# Altium schematic sheet RF-UNIT.SCHDOC
size 699 x 500 mm; SheetNumber: 1; SheetTotal: 1; DocumentName: Лист 1.SCHDOC
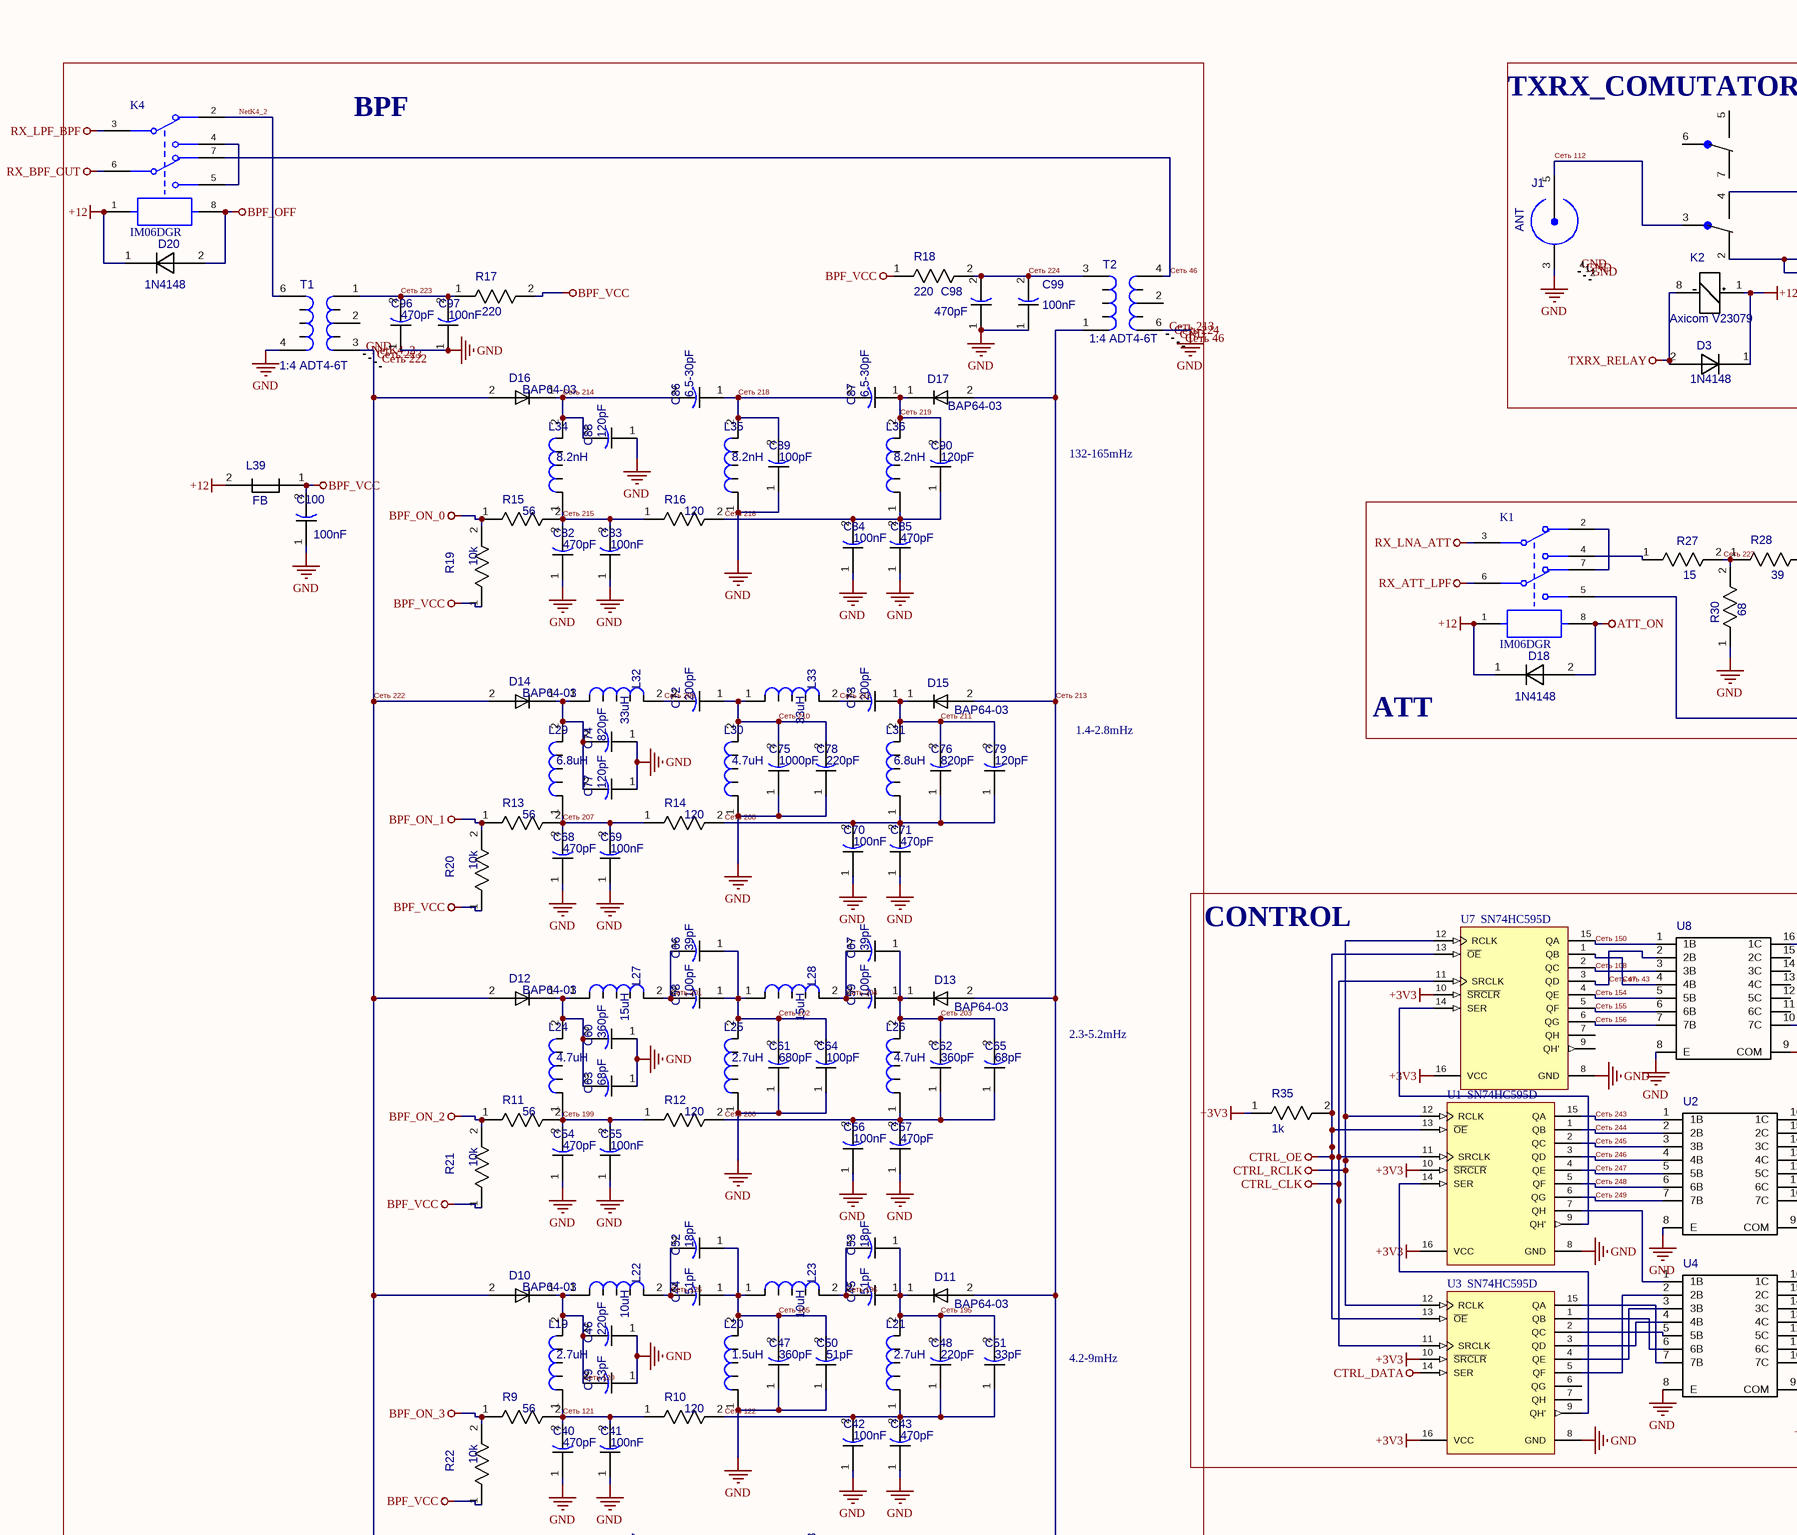
[diagram p0: RF-UNIT.SCHDOC, top left]
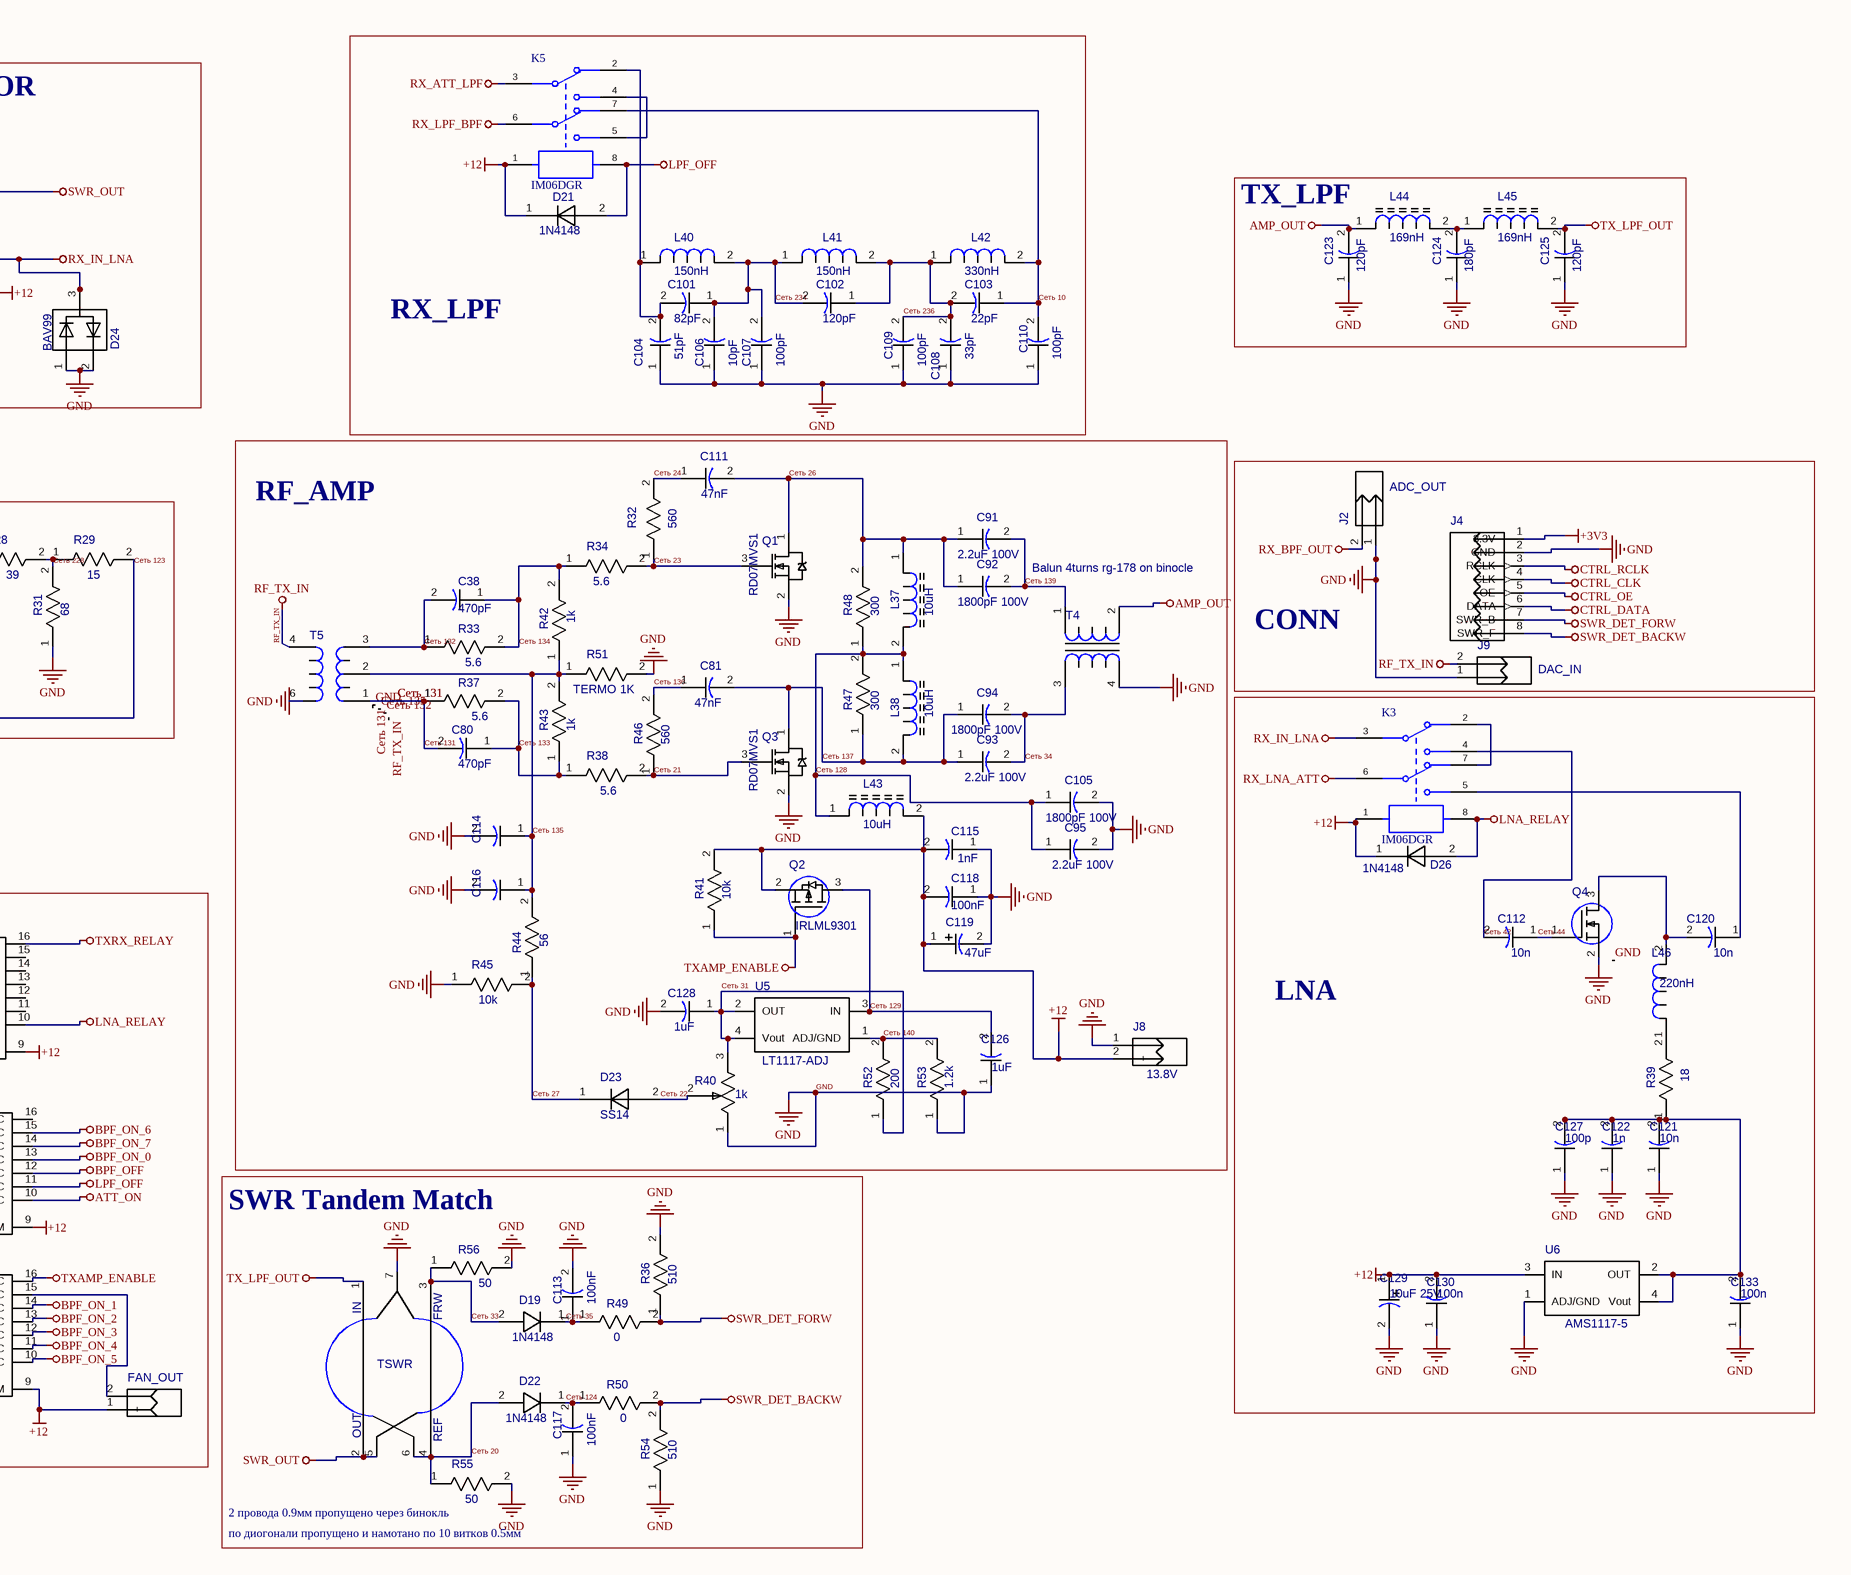
[diagram p1: RF-UNIT.SCHDOC, top right]
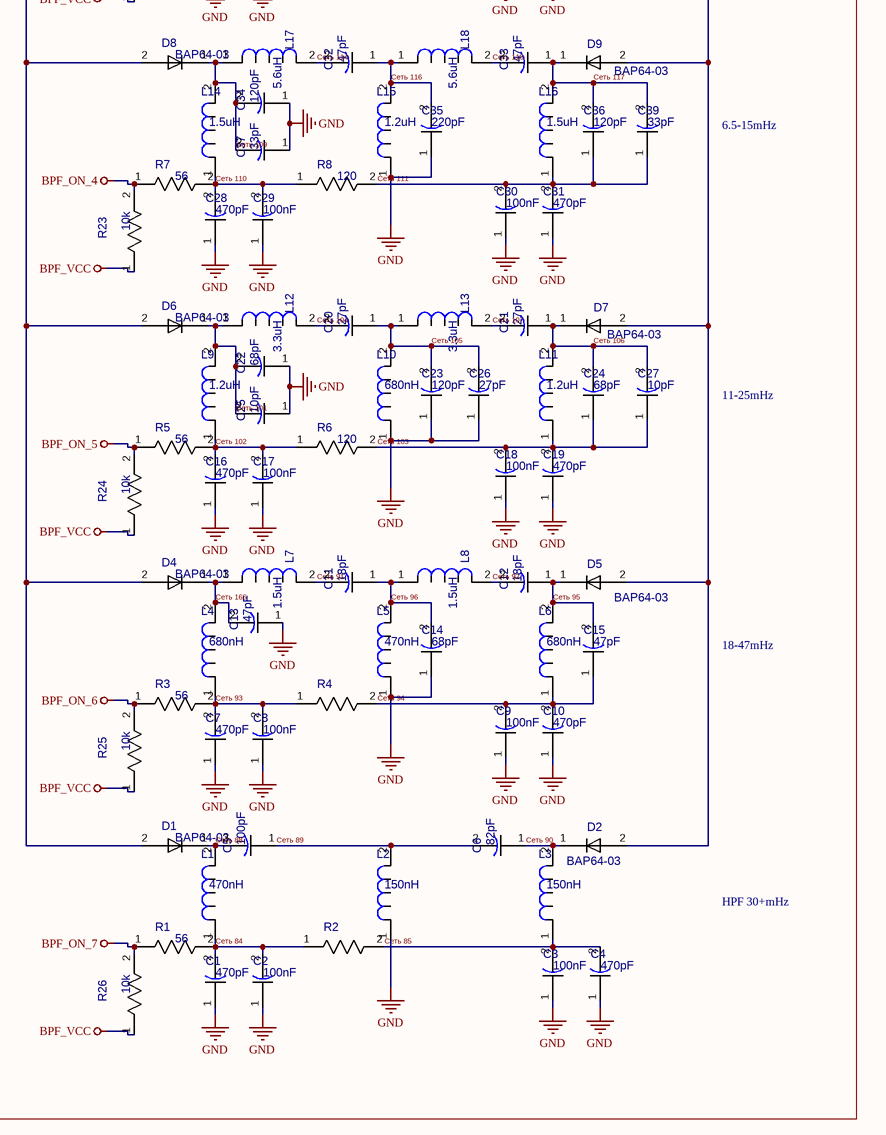
[diagram p2: RF-UNIT.SCHDOC, bottom left]

## Parts
C1  value 470pF  [CAP_0805]  (hidden comment: CAP_0805)
C2  value 100nF  [CAP_0805]  (hidden comment: CAP_0805)
C3  value 100nF  [CAP_0805]  (hidden comment: CAP_0805)
C4  value 470pF  [CAP_0805]  (hidden comment: CAP_0805)
C5  value 100pF  [CAP_0805]  (hidden comment: CAP_0805)
C6  value 82pF  [CAP_0805]  (hidden comment: CAP_0805)
C7  value 470pF  [CAP_0805]  (hidden comment: CAP_0805)
C8  value 100nF  [CAP_0805]  (hidden comment: CAP_0805)
C9  value 100nF  [CAP_0805]  (hidden comment: CAP_0805)
C10  value 470pF  [CAP_0805]  (hidden comment: CAP_0805)
C11  value 18pF  [CAP_0805]  (hidden comment: CAP_0805)
C12  value 18pF  [CAP_0805]  (hidden comment: CAP_0805)
C13  value 47pF  [CAP_0805]  (hidden comment: CAP_0805)
C14  value 68pF  [CAP_0805]  (hidden comment: CAP_0805)
C15  value 47pF  [CAP_0805]  (hidden comment: CAP_0805)
C16  value 470pF  [CAP_0805]  (hidden comment: CAP_0805)
C17  value 100nF  [CAP_0805]  (hidden comment: CAP_0805)
C18  value 100nF  [CAP_0805]  (hidden comment: CAP_0805)
C19  value 470pF  [CAP_0805]  (hidden comment: CAP_0805)
C20  value 27pF  [CAP_0805]  (hidden comment: CAP_0805)
C21  value 27pF  [CAP_0805]  (hidden comment: CAP_0805)
C22  value 68pF  [CAP_0805]  (hidden comment: CAP_0805)
C23  value 120pF  [CAP_0805]  (hidden comment: CAP_0805)
C24  value 68pF  [CAP_0805]  (hidden comment: CAP_0805)
C25  value 10pF  [CAP_0805]  (hidden comment: CAP_0805)
C26  value 27pF  [CAP_0805]  (hidden comment: CAP_0805)
C27  value 10pF  [CAP_0805]  (hidden comment: CAP_0805)
C28  value 470pF  [CAP_0805]  (hidden comment: CAP_0805)
C29  value 100nF  [CAP_0805]  (hidden comment: CAP_0805)
C30  value 100nF  [CAP_0805]  (hidden comment: CAP_0805)
C31  value 470pF  [CAP_0805]  (hidden comment: CAP_0805)
C32  value 47pF  [CAP_0805]  (hidden comment: CAP_0805)
C33  value 47pF  [CAP_0805]  (hidden comment: CAP_0805)
C34  value 120pF  [CAP_0805]  (hidden comment: CAP_0805)
C35  value 220pF  [CAP_0805]  (hidden comment: CAP_0805)
C36  value 120pF  [CAP_0805]  (hidden comment: CAP_0805)
C37  value 33pF  [CAP_0805]  (hidden comment: CAP_0805)
C38  value 470pF  [CAP_0805]  (hidden comment: CAP_0805)
C39  value 33pF  [CAP_0805]  (hidden comment: CAP_0805)
C40  value 470pF  [CAP_0805]  (hidden comment: CAP_0805)
C41  value 100nF  [CAP_0805]  (hidden comment: CAP_0805)
C42  value 100nF  [CAP_0805]  (hidden comment: CAP_0805)
C43  value 470pF  [CAP_0805]  (hidden comment: CAP_0805)
C44  value 51pF  [CAP_0805]  (hidden comment: CAP_0805)
C45  value 51pF  [CAP_0805]  (hidden comment: CAP_0805)
C46  value 220pF  [CAP_0805]  (hidden comment: CAP_0805)
C47  value 360pF  [CAP_0805]  (hidden comment: CAP_0805)
C48  value 220pF  [CAP_0805]  (hidden comment: CAP_0805)
C49  value 33pF  [CAP_0805]  (hidden comment: CAP_0805)
C50  value 51pF  [CAP_0805]  (hidden comment: CAP_0805)
C51  value 33pF  [CAP_0805]  (hidden comment: CAP_0805)
C52  value 18pF  [CAP_0805]  (hidden comment: CAP_0805)
C53  value 18pF  [CAP_0805]  (hidden comment: CAP_0805)
C54  value 470pF  [CAP_0805]  (hidden comment: CAP_0805)
C55  value 100nF  [CAP_0805]  (hidden comment: CAP_0805)
C56  value 100nF  [CAP_0805]  (hidden comment: CAP_0805)
C57  value 470pF  [CAP_0805]  (hidden comment: CAP_0805)
C58  value 100pF  [CAP_0805]  (hidden comment: CAP_0805)
C59  value 100pF  [CAP_0805]  (hidden comment: CAP_0805)
C60  value 360pF  [CAP_0805]  (hidden comment: CAP_0805)
C61  value 680pF  [CAP_0805]  (hidden comment: CAP_0805)
C62  value 360pF  [CAP_0805]  (hidden comment: CAP_0805)
C63  value 68pF  [CAP_0805]  (hidden comment: CAP_0805)
C64  value 100pF  [CAP_0805]  (hidden comment: CAP_0805)
C65  value 68pF  [CAP_0805]  (hidden comment: CAP_0805)
C66  value 39pF  [CAP_0805]  (hidden comment: CAP_0805)
C67  value 39pF  [CAP_0805]  (hidden comment: CAP_0805)
C68  value 470pF  [CAP_0805]  (hidden comment: CAP_0805)
C69  value 100nF  [CAP_0805]  (hidden comment: CAP_0805)
C70  value 100nF  [CAP_0805]  (hidden comment: CAP_0805)
C71  value 470pF  [CAP_0805]  (hidden comment: CAP_0805)
C72  value 200pF  [CAP_0805]  (hidden comment: CAP_0805)
C73  value 200pF  [CAP_0805]  (hidden comment: CAP_0805)
C74  value 820pF  [CAP_0805]  (hidden comment: CAP_0805)
C75  value 1000pF  [CAP_0805]  (hidden comment: CAP_0805)
C76  value 820pF  [CAP_0805]  (hidden comment: CAP_0805)
C77  value 120pF  [CAP_0805]  (hidden comment: CAP_0805)
C78  value 220pF  [CAP_0805]  (hidden comment: CAP_0805)
C79  value 120pF  [CAP_0805]  (hidden comment: CAP_0805)
C80  value 470pF  [CAP_0805]  (hidden comment: CAP_0805)
C81  value 47nF  [CAP_1206]  (hidden comment: CAP_1206)
C82  value 470pF  [CAP_0805]  (hidden comment: CAP_0805)
C83  value 100nF  [CAP_0805]  (hidden comment: CAP_0805)
C84  value 100nF  [CAP_0805]  (hidden comment: CAP_0805)
C85  value 470pF  [CAP_0805]  (hidden comment: CAP_0805)
C86  value 6.5-30pF  [CAP_1206]  (hidden comment: CAP_0805)
C87  value 6.5-30pF  [CAP_1206]  (hidden comment: CAP_0805)
C88  value 120pF  [CAP_0805]  (hidden comment: CAP_0805)
C89  value 100pF  [CAP_0805]  (hidden comment: CAP_0805)
C90  value 120pF  [CAP_0805]  (hidden comment: CAP_0805)
C91  value 2.2uF 100V  [CAP_1206]  (hidden comment: CAP_1206)
C92  value 1800pF 100V  [CAP_1206]  (hidden comment: CAP_1206)
C93  value 2.2uF 100V  [CAP_1206]  (hidden comment: CAP_1206)
C94  value 1800pF 100V  [CAP_1206]  (hidden comment: CAP_1206)
C95  value 2.2uF 100V  [CAP_1206]  (hidden comment: CAP_1206)
C96  value 470pF  [CAP_0805]  (hidden comment: CAP_0805)
C97  value 100nF  [CAP_0805]  (hidden comment: CAP_0805)
C98  value 470pF  [CAP_0805]  (hidden comment: CAP_0805)
C99  value 100nF  [CAP_0805]  (hidden comment: CAP_0805)
C100  value 100nF  [CAP_0805]  (hidden comment: CAP_0805)
C101  value 82pF  [CAP_0805]  (hidden comment: CAP_0805)
C102  value 120pF  [CAP_0805]  (hidden comment: CAP_0805)
C103  value 22pF  [CAP_0805]  (hidden comment: CAP_0805)
C104  value 51pF  [CAP_0805]  (hidden comment: CAP_0805)
C105  value 1800pF 100V  [CAP_1206]  (hidden comment: CAP_1206)
C106  value 10pF  [CAP_0805]  (hidden comment: CAP_0805)
C107  value 100pF  [CAP_0805]  (hidden comment: CAP_0805)
C108  value 33pF  [CAP_0805]  (hidden comment: CAP_0805)
C109  value 100pF  [CAP_0805]  (hidden comment: CAP_0805)
C110  value 100pF  [CAP_0805]  (hidden comment: CAP_0805)
C111  value 47nF  [CAP_1206]  (hidden comment: CAP_1206)
C112  value 10n  [CAP_0805]  (hidden comment: CAP_0805)
C113  value 100nF  [CAP_0805]  (hidden comment: CAP_0805)
C114  CAP_0805  [CAP_0805]  (value not drawn)
C115  value 1nF  [CAP_0805]  (hidden comment: CAP_0805)
C116  CAP_0805  [CAP_0805]  (value not drawn)
C117  value 100nF  [CAP_0805]  (hidden comment: CAP_0805)
C118  value 100nF  [CAP_0805]  (hidden comment: CAP_0805)
C119  value 47uF  [CAPAE_6.6x6.6h5.4]  (hidden comment: CAPAE_6.6x6.6h5.4)
C120  value 10n  [CAP_0805]  (hidden comment: CAP_0805)
C121  value 10n  [6-0805_M]  (hidden comment: CAP_0805)
C122  value 1n  [6-0805_M]  (hidden comment: CAP_0805)
C123  value 120pF  [CAP_1206]  (hidden comment: CAP_1206)
C124  value 180pF  [CAP_1206]  (hidden comment: CAP_1206)
C125  value 120pF  [CAP_1206]  (hidden comment: CAP_1206)
C126  value 1uF  [CAP_0805]  (hidden comment: CAP_0805)
C127  value 100p  [6-0805_M]  (hidden comment: CAP_0805)
C128  value 1uF  [CAP_0805]  (hidden comment: CAP_0805)
C129  value 10uF 25V  [CAPAE_5.3x5.3h6.1]  (hidden comment: CAPAE_5.3x5.3h6.1)
C130  value 100n  [CAP_0805]  (hidden comment: CAP_0805)
C133  value 100n  [CAP_0805]  (hidden comment: CAP_0805)
D1  BAP64-03  [SOD-323]
D2  BAP64-03  [SOD-323]
D3  1N4148  [1N4148]
D4  BAP64-03  [SOD-323]
D5  BAP64-03  [SOD-323]
D6  BAP64-03  [SOD-323]
D7  BAP64-03  [SOD-323]
D8  BAP64-03  [SOD-323]
D9  BAP64-03  [SOD-323]
D10  BAP64-03  [SOD-323]
D11  BAP64-03  [SOD-323]
D12  BAP64-03  [SOD-323]
D13  BAP64-03  [SOD-323]
D14  BAP64-03  [SOD-323]
D15  BAP64-03  [SOD-323]
D16  BAP64-03  [SOD-323]
D17  BAP64-03  [SOD-323]
D18  1N4148  [1N4148]
D19  value 1N4148  [DIODE_1206]  (hidden comment: DIODE_1206)
D20  1N4148  [1N4148]
D21  1N4148  [1N4148]
D22  value 1N4148  [DIODE_1206]  (hidden comment: DIODE_1206)
D23  SS14  [SS14]
D24  BAV99  [SOT23]
D26  1N4148  [1N4148]
FAN_OUT  51022-0200  [51022-0200]  (value not drawn)
J1  value ANT  [31-5431]  (hidden comment: 31-5431)
J2  value ADC_OUT  [644456-2]  (hidden comment: 644456-2)
J4  90131-0124  [90131-0124]  (value not drawn)
J8  value 13.8V  [1986717-2]  (hidden comment: 1986717-2)
J9  value DAC_IN  [644456-2]  (hidden comment: 644456-2)
K1  IM06DGR  [TECO-SMT-8_V]
K2  Axicom V23079  [V23079]
K3  IM06DGR  [TECO-SMT-8_V]
K4  IM06DGR  [TECO-SMT-8_V]
K5  IM06DGR  [TECO-SMT-8_V]
L1  value 470nH  [IND_0805]  (hidden comment: IND_0805)
L2  value 150nH  [IND_0805]  (hidden comment: IND_0805)
L3  value 150nH  [IND_0805]  (hidden comment: IND_0805)
L4  value 680nH  [IND_0805]  (hidden comment: IND_0805)
L5  value 470nH  [IND_0805]  (hidden comment: IND_0805)
L6  value 680nH  [IND_0805]  (hidden comment: IND_0805)
L7  value 1.5uH  [IND_0805]  (hidden comment: IND_0805)
L8  value 1.5uH  [IND_0805]  (hidden comment: IND_0805)
L9  value 1.2uH  [IND_0805]  (hidden comment: IND_0805)
L10  value 680nH  [IND_0805]  (hidden comment: IND_0805)
L11  value 1.2uH  [IND_0805]  (hidden comment: IND_0805)
L12  value 3.3uH  [IND_0805]  (hidden comment: IND_0805)
L13  value 3.3uH  [IND_0805]  (hidden comment: IND_0805)
L14  value 1.5uH  [IND_0805]  (hidden comment: IND_0805)
L15  value 1.2uH  [IND_0805]  (hidden comment: IND_0805)
L16  value 1.5uH  [IND_0805]  (hidden comment: IND_0805)
L17  value 5.6uH  [IND_0805]  (hidden comment: IND_0805)
L18  value 5.6uH  [IND_0805]  (hidden comment: IND_0805)
L19  value 2.7uH  [IND_0805]  (hidden comment: IND_0805)
L20  value 1.5uH  [IND_0805]  (hidden comment: IND_0805)
L21  value 2.7uH  [IND_0805]  (hidden comment: IND_0805)
L22  value 10uH  [IND_0805]  (hidden comment: IND_0805)
L23  value 10uH  [IND_0805]  (hidden comment: IND_0805)
L24  value 4.7uH  [IND_0805]  (hidden comment: IND_0805)
L25  value 2.7uH  [IND_0805]  (hidden comment: IND_0805)
L26  value 4.7uH  [IND_0805]  (hidden comment: IND_0805)
L27  value 15uH  [IND_0805]  (hidden comment: IND_0805)
L28  value 15uH  [IND_0805]  (hidden comment: IND_0805)
L29  value 6.8uH  [IND_0805]  (hidden comment: IND_0805)
L30  value 4.7uH  [IND_0805]  (hidden comment: IND_0805)
L31  value 6.8uH  [IND_0805]  (hidden comment: IND_0805)
L32  value 33uH  [IND_0805]  (hidden comment: IND_0805)
L33  value 33uH  [IND_0805]  (hidden comment: IND_0805)
L34  value 8.2nH  [IND_0805]  (hidden comment: IND_0805)
L35  value 8.2nH  [IND_0805]  (hidden comment: IND_0805)
L36  value 8.2nH  [IND_0805]  (hidden comment: IND_0805)
L37  value 10uH  [IND_FERRITE_CORE]  (hidden comment: IND_FERRITE_CORE)
L38  value 10uH  [IND_FERRITE_CORE]  (hidden comment: IND_FERRITE_CORE)
L39  value FB  [IND_FERRITE_BEAD]  (hidden comment: IND_FERRITE_BEAD)
L40  value 150nH  [IND_0805]  (hidden comment: IND_0805)
L41  value 150nH  [IND_0805]  (hidden comment: IND_0805)
L42  value 330nH  [IND_0805]  (hidden comment: IND_0805)
L43  value 10uH  [IND_FERRITE_CORE]  (hidden comment: IND_FERRITE_CORE)
L44  value 169nH  [IND_FERRITE_CORE_1]  (hidden comment: IND_FERRITE_CORE)
L45  value 169nH  [IND_FERRITE_CORE_1]  (hidden comment: IND_FERRITE_CORE)
L46  value 220nH  [IND_1206]  (hidden comment: IND_1206)
Q1  RD07MVS1  [RD07MVS1]
Q2  value IRLML9301  [SOT23]  (hidden comment: MOSFET_ENH_PD)
Q3  RD07MVS1  [RD07MVS1]
Q4  PGA-103+  [SOT89]  (value not drawn)
R1  value 56  [RES_0805]  (hidden comment: RES_0805)
R2  RES_0805  [RES_0805]  (value not drawn)
R3  value 56  [RES_0805]  (hidden comment: RES_0805)
R4  RES_0805  [RES_0805]  (value not drawn)
R5  value 56  [RES_0805]  (hidden comment: RES_0805)
R6  value 120  [RES_0805]  (hidden comment: RES_0805)
R7  value 56  [RES_0805]  (hidden comment: RES_0805)
R8  value 120  [RES_0805]  (hidden comment: RES_0805)
R9  value 56  [RES_0805]  (hidden comment: RES_0805)
R10  value 120  [RES_0805]  (hidden comment: RES_0805)
R11  value 56  [RES_0805]  (hidden comment: RES_0805)
R12  value 120  [RES_0805]  (hidden comment: RES_0805)
R13  value 56  [RES_0805]  (hidden comment: RES_0805)
R14  value 120  [RES_0805]  (hidden comment: RES_0805)
R15  value 56  [RES_0805]  (hidden comment: RES_0805)
R16  value 120  [RES_0805]  (hidden comment: RES_0805)
R17  value 220  [RES_0805]  (hidden comment: RES_0805)
R18  value 220  [RES_0805]  (hidden comment: RES_0805)
R19  value 10k  [RES_0805]  (hidden comment: RES_0805)
R20  value 10k  [RES_0805]  (hidden comment: RES_0805)
R21  value 10k  [RES_0805]  (hidden comment: RES_0805)
R22  value 10k  [RES_0805]  (hidden comment: RES_0805)
R23  value 10k  [RES_0805]  (hidden comment: RES_0805)
R24  value 10k  [RES_0805]  (hidden comment: RES_0805)
R25  value 10k  [RES_0805]  (hidden comment: RES_0805)
R26  value 10k  [RES_0805]  (hidden comment: RES_0805)
R27  value 15  [RES_0805]  (hidden comment: RES_0805)
R28  value 39  [RES_0805]  (hidden comment: RES_0805)
R29  value 15  [RES_0805]  (hidden comment: RES_0805)
R30  value 68  [RES_0805]  (hidden comment: RES_0805)
R31  value 68  [RES_0805]  (hidden comment: RES_0805)
R32  value 560  [RES_0805]  (hidden comment: RES_0805)
R33  value 5.6  [RES_0805]  (hidden comment: RES_0805)
R34  value 5.6  [RES_1206]  (hidden comment: RES_1206)
R35  value 1k  [RES_0805]  (hidden comment: RES_0805)
R36  value 510  [RES_0805]  (hidden comment: RES_0805)
R37  value 5.6  [RES_0805]  (hidden comment: RES_0805)
R38  value 5.6  [RES_1206]  (hidden comment: RES_1206)
R39  value 18  [RES_1206]  (hidden comment: RES_1206)
R40  value 1k  [306J]  (hidden comment: 306J)
R41  value 10k  [RES_0805]  (hidden comment: RES_0805)
R42  value 1k  [RES_0805]  (hidden comment: RES_0805)
R43  value 1k  [RES_0805]  (hidden comment: RES_0805)
R44  value 56  [RES_0805]  (hidden comment: RES_0805)
R45  value 10k  [RES_0805]  (hidden comment: RES_0805)
R46  value 560  [RES_0805]  (hidden comment: RES_0805)
R47  value 300  [RES_1206]  (hidden comment: RES_1206)
R48  value 300  [RES_1206]  (hidden comment: RES_1206)
R49  value 0  [RES_0805]  (hidden comment: RES_0805)
R50  value 0  [RES_0805]  (hidden comment: RES_0805)
R51  value TERMO 1K  [RES]  (hidden comment: RES)
R52  value 200  [RES_0805]  (hidden comment: RES_0805)
R53  value 1.2k  [RES_0805]  (hidden comment: RES_0805)
R54  value 510  [RES_0805]  (hidden comment: RES_0805)
R55  value 50  [RES_1206]  (hidden comment: RES_1206)
R56  value 50  [RES_1206]  (hidden comment: RES_1206)
T1  value 1:4 ADT4-6T  [TRANSF_ACORE2]  (hidden comment: TRANSF_ACORE2)
T2  value 1:4 ADT4-6T  [TRANSF_ACORE2_1]  (hidden comment: TRANSF_ACORE2)
T4  value Balun 4turns rg-178 on binocle  [TRANSF_ICORE]  (hidden comment: TRANSF_ICORE)
T5  TRANSF_ACORE2  [TRANSF_ACORE2_2]  (value not drawn)
TSWR  SWR_TANDEM_MATCH  [SWR_TANDEM_MATCH]  (value not drawn)
U1  SN74HC595D  [D0016A_L]
U2  ULN2003BDR  [ULN2003BDR]  (value not drawn)
U3  SN74HC595D  [D0016A_L]
U4  ULN2003BDR  [ULN2003BDR]  (value not drawn)
U5  value LT1117-ADJ  [LT1117IST-ADJ]  (hidden comment: LT1117IST-ADJ)
U6  AMS1117-5  [AMS1117-5]
U7  SN74HC595D  [D0016A_L]
U8  ULN2003BDR  [ULN2003BDR]  (value not drawn)

## Blocks framed on the sheet
RX_LPF: C101-C104 C106-C110 D21 K5 L40-L42
BPF: C1-C37 C39-C79 C82-C90 C96-C100 D1 D2 D4-D17 D20 K4 L1-L36 L39 R1-R26 T1 T2
TXRX_COMUTATOR: D3 D24 J1 K2
TX_LPF: C123-C125 L44 L45
RF_AMP: C38 C80 C81 C91-C95 C105 C111 C114-C116 C118 C119 C126 C128 D23 J8 L37 L38 L43 Q1-Q3 R32-R34 R37 R38 R40-R48 R51-R53 T4 T5 U5
CONN: J2 J4 J9
ATT: D18 K1 R27-R31
LNA: C112 C120-C122 C127 C129 C130 C133 D26 K3 L46 Q4 R39 U6
CONTROL: FAN_OUT R35 U1-U4 U7 U8
SWR Tandem Match: C113 C117 D19 D22 R36 R49 R50 R54-R56 TSWR

## Nets
+3V3: J4.1(3.3V) R35.1 U1.10(~{SRCLR}) U1.16(VCC) U3.10(~{SRCLR}) U3.16(VCC) U7.10(~{SRCLR}) U7.16(VCC)
+12: C115.2 C118.2 C119.1(PLUS) C129.1(PLUS) C130.2 D3.1(K) D18.1(K) D20.1(K) D21.1(K) D26.1(K) FAN_OUT.1(+) J8.2(+) K1.1 K2.1(+) K3.1 K4.1 K5.1 L39.2 L43.2(B) Q2.2(S) R41.2 U2.9(COM) U4.9(COM) U6.3(IN) U8.9(COM)
AMP_OUT: C123.2 L44.1(A) T4.2(P2)
ATT_ON: D18.2(A) K1.8 U2.10(7C)
BPF_OFF: D20.2(A) K4.8 U2.12(5C)
BPF_ON_0: R15.1 R19.2 U2.13(4C)
BPF_ON_1: R13.1 R20.2 U4.14(3C)
BPF_ON_2: R11.1 R21.2 U4.13(4C)
BPF_ON_3: R9.1 R22.2 U4.12(5C)
BPF_ON_4: R7.1 R23.2 U4.11(6C)
BPF_ON_5: R5.1 R24.2 U4.10(7C)
BPF_ON_6: R3.1 R25.2 U2.15(2C)
BPF_ON_7: R1.1 R26.2 U2.14(3C)
BPF_VCC: C100.2 L39.1 R17.2 R18.1 R19.1 R20.1 R21.1 R22.1 R23.1 R24.1 R25.1 R26.1
CTRL_CLK: J4.4(CLK) U1.11(SRCLK) U3.11(SRCLK) U7.11(SRCLK)
CTRL_DATA: J4.6(DATA) U3.14(SER)
CTRL_OE: J4.5(OE) R35.2 U1.13(~{OE}) U3.13(~{OE}) U7.13(~{OE})
CTRL_RCLK: J4.3(RCLK) U1.12(RCLK) U3.12(RCLK) U7.12(RCLK)
GND: C1.1 C2.1 C3.1 C4.1 C7.1 C8.1 C9.1 C10.1 C13.1 C14.1 C16.1 C17.1 C18.1 C19.1 C22.1 C23.1 C25.1 C26.1 C28.1 C29.1 C30.1 C31.1 C34.1 C35.1 C37.1 C40.1 C41.1 C42.1 C43.1 C46.1 C47.1 C49.1 C50.1 C54.1 C55.1 C56.1 C57.1 C60.1 C61.1 C63.1 C64.1 C68.1 C69.1 C70.1 C71.1 C74.1 C75.1 C77.1 C78.1 C82.1 C83.1 C84.1 C85.1 C88.1 C89.1 C95.2 C96.1 C97.1 C98.1 C99.1 C100.1 C104.1 C105.2 C106.1 C107.1 C108.1 C109.1 C110.1 C113.2 C114.2 C115.1 C116.2 C117.1 C118.1 C119.2(MINUS) C121.1 C122.1 C123.1 C124.1 C125.1 C126.1 C127.1 C128.2 C129.2(MINUS) C130.1 C133.1 D24.1(A(D1)) D24.2(C(D2)) J1.1(GND) J1.2(GND) J1.3(GND) J1.4(GND) J2.1(P1) J4.2(GND) J8.1(-) J9.1(P1) L2.1 L5.1 L10.1 L15.1 L20.1 L25.1 L30.1 L35.1 Q1.2(S) Q3.2(S) Q4.0 Q4.2(S) R30.1 R31.1 R36.2 R40.1(CCW) R45.1 R51.2(B) R53.1 R54.1 R55.2 R56.2 T1.4(P1) T1.11 T2.6(S1) T2.10 T4.4(S2) T5.6(P1) T5.10 TSWR.7 U1.8(GND) U2.8(E) U3.8(GND) U4.8(E) U6.1(ADJ/GND) U7.8(GND) U8.8(E)
LNA_RELAY: D26.2(A) K3.8 U8.10(7C)
LPF_OFF: D21.2(A) K5.8 U2.11(6C)
RF_TX_IN: J9.2(P2) T5.4(P2) T5.11
RX_ATT_LPF: K1.6 K5.3
RX_BPF_OUT: J2.2(P2) K4.6
RX_IN_LNA: D24.3(C(D1),A(D2)) K2.2(O) K3.3
RX_LNA_ATT: K1.3 K3.6
RX_LPF_BPF: K4.3 K5.6
SWR_DET_BACKW: J4.8(SWR_F) R50.2 R54.2
SWR_DET_FORW: J4.7(SWR_B) R36.1 R49.2
SWR_OUT: K2.4(S) TSWR.2 TSWR.5
TX_LPF_OUT: C125.2 L45.2(B) TSWR.1
TXAMP_ENABLE: Q2.1(G) R41.1 U4.16(1C)
TXRX_RELAY: D3.2(A) K2.8(-) U8.16(1C)
NetK4_2: K4.2 T1.6(P2) T1.10
Сеть 10: C103.1 C110.2 K5.7 L42.2
Сеть 20: D22.2(A) R55.1 TSWR.4 TSWR.6
Сеть 21: Q3.3(G) R38.2 R46.1
Сеть 22: D23.2(A) R40.2(W)
Сеть 23: Q1.3(G) R32.1 R34.2
Сеть 24: C111.1 R32.2
Сеть 26: C91.1 C92.1 C111.2 L37.1(A) Q1.1(D) R48.2
Сеть 27: D23.1(K) R44.1 R45.2
Сеть 31: C128.1 R40.3(CW) R52.1 U5.2(OUT) U5.4(Vout)
Сеть 33: D19.2(A) R56.1 TSWR.3
Сеть 34: C93.2 C94.2 T4.3(S1)
Сеть 35: C113.1 D19.1(K) R49.1
Сеть 42: C112.2 K3.4
Сеть 43: U7.1(QB) U8.4(4B)
Сеть 44: C112.1 Q4.1(G)
Сеть 46: K4.7 T2.4(S3) T2.11
Сеть 47: U7.3(QD) U8.2(2B)
Сеть 84: C1.2 C2.2 L1.1 R1.2 R2.1
Сеть 85: C3.2 C4.2 L3.1 R2.2
Сеть 88: C5.2 D1.1((C)) L1.2
Сеть 89: C5.1 C6.2 L2.2
Сеть 90: C6.1 D2.1((C)) L3.2
Сеть 91: C11.2 L7.2
Сеть 92: C12.2 L8.2
Сеть 93: C7.2 C8.2 L4.1 R3.2 R4.1
Сеть 94: C9.2 C10.2 C15.1 L6.1 R4.2
Сеть 95: C12.1 C15.2 D5.1((C)) L6.2
Сеть 96: C11.1 C14.2 L5.2 L8.1
Сеть 101: C22.2 C25.2 D6.1((C)) L9.2 L12.1
Сеть 102: C16.2 C17.2 L9.1 R5.2 R6.1
Сеть 103: C18.2 C19.2 C24.1 C27.1 L11.1 R6.2
Сеть 104: C20.2 L12.2
Сеть 105: C20.1 C23.2 C26.2 L10.2 L13.1
Сеть 106: C21.1 C24.2 C27.2 D7.1((C)) L11.2
Сеть 107: C21.2 L13.2
Сеть 108: U7.2(QC) U8.3(3B)
Сеть 109: C34.2 C37.2 D8.1((C)) L14.2 L17.1
Сеть 110: C28.2 C29.2 L14.1 R7.2 R8.1
Сеть 111: C30.2 C31.2 C36.1 C39.1 L16.1 R8.2
Сеть 112: J1.5(CON) K2.3(P)
Сеть 114: C32.2 L17.2
Сеть 116: C32.1 C35.2 L15.2 L18.1
Сеть 117: C33.1 C36.2 C39.2 D9.1((C)) L16.2
Сеть 118: C33.2 L18.2
Сеть 120: C46.2 C49.2 D10.1((C)) L19.2 L22.1
Сеть 121: C40.2 C41.2 L19.1 R9.2 R10.1
Сеть 122: C42.2 C43.2 C48.1 C51.1 L21.1 R10.2
Сеть 123: K1.5 R29.2
Сеть 124: C117.2 D22.1(K) R50.1
Сеть 125: C44.2 C52.2 L22.2
Сеть 128: C95.1 C105.1 L37.2(B) L38.1(A) L43.1(A) R47.2 R48.1
Сеть 129: C126.2 Q2.3(D) U5.3(IN)
Сеть 131: C80.2 R37.1 T5.1(S1) T5.7
Сеть 132: C38.2 R33.1 T5.3(S3) T5.9
Сеть 133: C80.1 R37.2 R38.1 R43.1
Сеть 134: C38.1 R33.2 R34.1 R42.2
Сеть 135: C114.1 C116.1 R42.1 R43.2 R44.2 R51.1(A) T5.2(S2) T5.8
Сеть 136: C81.1 R46.2
Сеть 137: C81.2 C93.1 C94.1 L38.2(B) Q3.1(D) R47.1
Сеть 139: C91.2 C92.2 T4.1(P1)
Сеть 140: R52.2 R53.2 U5.1(ADJ/GND)
Сеть 150: U7.15(QA) U8.1(1B)
Сеть 154: U7.4(QE) U8.5(5B)
Сеть 155: U7.5(QF) U8.6(6B)
Сеть 156: U7.6(QG) U8.7(7B)
Сеть 166: C13.2 D4.1((C)) L4.2 L7.1
Сеть 185: C44.1 C47.2 C50.2 C52.1 L20.2 L23.1
Сеть 195: C45.1 C48.2 C51.2 C53.1 D11.1((C)) L21.2
Сеть 196: C45.2 C53.2 L23.2
Сеть 199: C54.2 C55.2 L24.1 R11.2 R12.1
Сеть 200: C56.2 C57.2 C62.1 C65.1 L26.1 R12.2
Сеть 201: C58.2 C66.2 L27.2
Сеть 202: C58.1 C61.2 C64.2 C66.1 L25.2 L28.1
Сеть 203: C59.1 C62.2 C65.2 C67.1 D13.1((C)) L26.2
Сеть 204: C59.2 C67.2 L28.2
Сеть 207: C68.2 C69.2 L29.1 R13.2 R14.1
Сеть 208: C70.2 C71.2 C76.1 C79.1 L31.1 R14.2
Сеть 209: C72.2 L32.2
Сеть 210: C72.1 C75.2 C78.2 L30.2 L33.1
Сеть 211: C73.1 C76.2 C79.2 D15.1((C)) L31.2
Сеть 212: C73.2 L33.2
Сеть 213: D2.2((A)) D5.2((A)) D7.2((A)) D9.2((A)) D11.2((A)) D13.2((A)) D15.2((A)) D17.2((A)) T2.1(P1) T2.7
Сеть 214: C86.2 C88.2 D16.1((C)) L34.2
Сеть 215: C82.2 C83.2 L34.1 R15.2 R16.1
Сеть 216: C84.2 C85.2 C90.1 L36.1 R16.2
Сеть 218: C86.1 C87.2 C89.2 L35.2
Сеть 219: C87.1 C90.2 D17.1((C)) L36.2
Сеть 222: D1.2((A)) D4.2((A)) D6.2((A)) D8.2((A)) D10.2((A)) D12.2((A)) D14.2((A)) D16.2((A)) T1.3(S1) T1.9
Сеть 223: C96.2 C97.2 R17.1 T1.1(S3) T1.7
Сеть 224: C98.2 C99.2 R18.2 T2.3(P2) T2.9
Сеть 227: R27.2 R28.1 R30.2
Сеть 228: R28.2 R29.1 R31.2
Сеть 234: C101.1 C102.2 C106.2 C107.2 L40.2 L41.1
Сеть 236: C102.1 C103.2 C108.2 C109.2 L41.2 L42.1
Сеть 243: U1.15(QA) U2.1(1B)
Сеть 244: U1.1(QB) U2.2(2B)
Сеть 245: U1.2(QC) U2.3(3B)
Сеть 246: U1.3(QD) U2.4(4B)
Сеть 247: U1.4(QE) U2.5(5B)
Сеть 248: U1.5(QF) U2.6(6B)
Сеть 249: U1.6(QG) U2.7(7B)
NetC60_2: C60.2 C63.2 D12.1((C)) L24.2 L27.1
NetC74_2: C74.2 C77.2 D14.1((C)) L29.2 L32.1
NetC101_2: C101.2 C104.2 K5.2 L40.1
NetC120_1: C120.1 K3.5
NetC120_2: C120.2 L46.2 Q4.3(D)
NetC121_2: C121.2 C122.2 C127.2 C133.2 R39.1 U6.2(OUT) U6.4(Vout)
NetC124_2: C124.2 L44.2(B) L45.1(A)
NetFAN_OUT_2: FAN_OUT.2(-) U4.15(2C)
NetK1_2: K1.2 K1.7
NetK1_4: K1.4 R27.1
NetK3_2: K3.2 K3.7
NetK4_4: K4.4 K4.5
NetK5_4: K5.4 K5.5
NetL46_1: L46.1 R39.2
NetU1_7: U1.7(QH) U4.1(1B)
NetU1_9: U1.9(QH') U7.14(SER)
NetU1_14: U1.14(SER) U3.9(QH')
NetU3_1: U3.1(QB) U4.6(6B)
NetU3_2: U3.2(QC) U4.5(5B)
NetU3_3: U3.3(QD) U4.4(4B)
NetU3_4: U3.4(QE) U4.3(3B)
NetU3_5: U3.5(QF) U4.2(2B)
NetU3_15: U3.15(QA) U4.7(7B)

Not connected (* = marked no-connect by the designer): K2 5(S) 6(P) 7(O); T1 2(S2); T2 2(S2); U2 16(1C); U3 6(QG) 7(QH); U7 7(QH) 9(QH'); U8 11(6C) 12(5C) 13(4C) 14(3C) 15(2C)

## Notes on the sheet
- 132-165mHz
- 1.4-2.8mHz
- 2.3-5.2mHz
- 4.2-9mHz
- (near R55) 2 провода 0.9мм пропущено через бинокль
- (near R55) по диогонали пропущено и намотано по 10 витков 0.5мм
- 6.5-15mHz
- 11-25mHz
- 18-47mHz
- HPF 30+mHz
- (in symbol SWR_TANDEM_MATCH) IN; FRW; OUT; REF

## Library data of the parts
C114 = CAP_0805: Value: 8200pF
C116 = CAP_0805: Value: 100n
J4 = 90131-0124: Value: MOTHERBOARD
K1 K3-K5 = CMP-2000-05421-1: Signal Relay, 5 A, 12 VDC, -40 to 85 degC, 8-Pin SMD, RoHS, Tape and Reel; Manufacturer: TE Connectivity; Contact Voltage AC Nom: 250V; Approval Category: ULRecognised; Contact Current Max: 5A; Coil Type: DC; Coil Voltage VDC Nom: 12V; Dielectric Voltage Coil to Contact: 1800V; Switching Power Max: 62.5VA; Switching Voltage AC / DC Max: 250VAC; External Depth: 10mm; Approval Bodies: EN/IEC; No. of Pins: 8; Contact Configuration: DPCO; Contact Voltage DC Nom: 220V; Coil Resistance: 1.028kohm; Coil Power Cont: 140mW; Dielectric Voltage Contact to Contact: 1000V; Contact Current DC Max: 2A; Switching Voltage Max: 220VDC; Insulation Resistance: 1000Mohm; No. of Poles: 2; Switching Voltage AC / DC Min: 100µV; Contact Resistance: 50mohm; External Width: 6mm; Switch Power Max: 60W; Operating Voltage Range: 9Vto28.9V; Insulation Resistance Voltage: 500VDC; External Length / Height: 5.65mm; Relay Mounting: SMD; Package Reference: SMT-8; Datasheet URL: http://www.farnell.com/datasheets/1717896.pdf; Manufacturer URL: http://www.te.com/; Operating Temperature Max: 85degC; Series: IM; Mounting Type: SMT; Package Description: 8-Pin Surface Mount Device, Body 10 x 6 mm; DC Coil Power: 140mW; MSL: MSL3-168hours; Contact Current AC Max: 2A; Datasheet Version: Rev. 0411, 04/2011; Operating Temperature Min: -40degC; External Height: 5.65mm
L37 L38 L43-L45 = IND_FERRITE_CORE: Inductor
L39 = IND_FERRITE_BEAD: Ferrite bead on conductor
Q2 = MOSFET_ENH_PD: MOSFET
Q4 = PGA-103+: MOSFET; Value: PGA-103+
R2 R4 = RES_0805: Value: 120
T1 T2 = TRANSF_ACORE2: Transformer
T4 = TRANSF_ICORE: Transformer
T5 = TRANSF_ACORE2: Transformer; Value: 1:1 ADT1-6T
U1 U3 U7 = CMP-0780-00038-3: 8-Bit Shift Registers With 3-State Output Registers, D0016A, TUBE; Manufacturer: Texas Instruments; Bits: 8; F @ Nom Voltage(Max)(Mhz): 28; Voltage(Nom)(V): 6; ICC @ Nom Voltage(Max)(mA): 0.08; Output Drive (IOL/IOH)(Max)(mA): 7.8/-7.8; tpd @ Nom Voltage(Max)(ns): 34; 3-State Output: Yes; VCC(Min)(V): 2; Output Type: CMOS; Technology Family: HC; Rating: Military; Generic Part Number: SN74HC595; PackageReference: D0016A; Code_JEDEC: MS-012 variation AC; Operating Temperature Range(C): -40 to 85; VCC(Max)(V): 6; DatasheetVersion: SCLS041H; Input Type: CMOS; PackageVersion: http://www.ti.com/lit/ml/mpds178g/mpds178g.pdf
D1 D2 D4-D17 = BAP64-03: Value: BAP64-03
D3 D18 D20 D21 D26 = 1N4148: Value: 1N4148
D23 = SS14: Value: SS14
D24 = BAV99: Value: BAV99
K2 = Axicom V23079: Value: *
Q1 Q3 = RD07MVS1: Value: RD07MVS1
U2 U4 U8 = ULN2003BDR: Value: ULN2003
U6 = AMS1117-5: Value: AMS1117-5